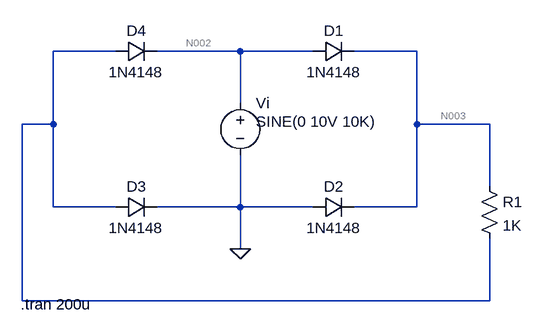
[diagram p0: schematic Draft1.asc]
Draft1.asc, the LTspice schematic file:
Version 4
SHEET 1 880 680
WIRE 32 64 -64 64
WIRE 224 64 96 64
WIRE 336 64 224 64
WIRE 496 64 400 64
WIRE 224 144 224 64
WIRE -64 176 -64 64
WIRE -64 176 -112 176
WIRE 496 176 496 64
WIRE 608 176 496 176
WIRE 608 272 608 176
WIRE -64 304 -64 176
WIRE 32 304 -64 304
WIRE 224 304 224 224
WIRE 224 304 96 304
WIRE 336 304 224 304
WIRE 496 304 496 176
WIRE 496 304 400 304
WIRE 224 368 224 304
WIRE -112 448 -112 176
WIRE 608 448 608 352
WIRE 608 448 -112 448
FLAG 224 368 0
SYMBOL voltage 224 128 R0
WINDOW 3 24 44 Left 2
WINDOW 123 0 0 Left 0
WINDOW 39 0 0 Left 0
SYMATTR InstName Vi
SYMATTR Value SINE(0 10V 10K)
SYMBOL res 592 256 R0
SYMATTR InstName R1
SYMATTR Value 1K
SYMBOL diode 32 80 R270
WINDOW 0 32 32 VTop 2
WINDOW 3 0 32 VBottom 2
SYMATTR InstName D4
SYMATTR Value 1N4148
SYMBOL diode 32 320 R270
WINDOW 0 32 32 VTop 2
WINDOW 3 0 32 VBottom 2
SYMATTR InstName D3
SYMATTR Value 1N4148
SYMBOL diode 336 320 R270
WINDOW 0 32 32 VTop 2
WINDOW 3 0 32 VBottom 2
SYMATTR InstName D2
SYMATTR Value 1N4148
SYMBOL diode 336 80 R270
WINDOW 0 32 32 VTop 2
WINDOW 3 0 32 VBottom 2
SYMATTR InstName D1
SYMATTR Value 1N4148
TEXT -114 454 Left 2 !.tran 200u

The netlist it stands for:
* Draft1.asc
Vi N002 0 SINE(0 10V 10K)
R1 N003 N001 1K
D4 N001 N002 1N4148
D3 N001 0 1N4148
D2 0 N003 1N4148
D1 N002 N003 1N4148
.model D D
.lib standard.dio
.tran 200u
.backanno
.end

* Results of the author's LTspice run, read from the files saved beside the schematic
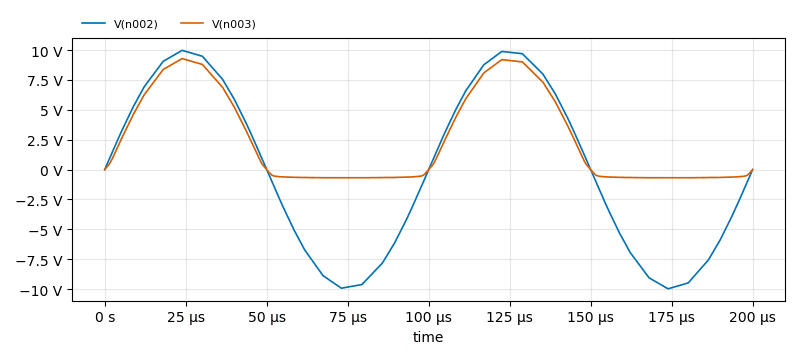
[diagram p1: Transient Analysis of Draft1.asc, plotted from the saved traces]
* Transient Analysis, 1 run:
*   V(n002): min -9.975 V, max 9.976 V, average 186.7 µV, rms 7.022 V, last 0 V
*   V(n003): min -686.6 mV, max 9.289 V, average 2.527 V, rms 4.567 V, last 0 V